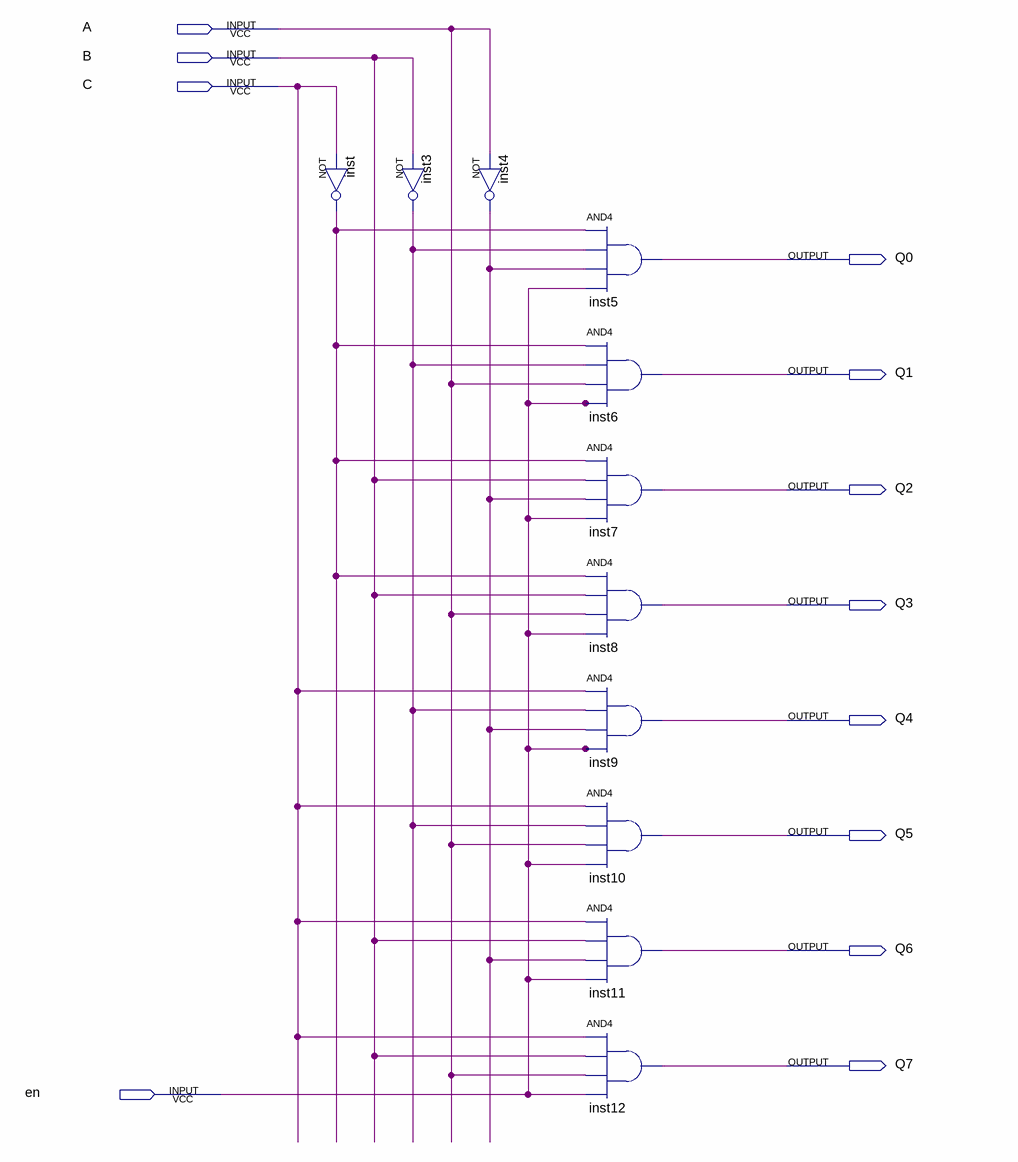
[diagram p0: schematic sheet]
// Quartus schematic ex_05.bdf as structural Verilog: 11 symbols, 12 pins
module ex_05 (
  input  A,
  input  B,
  input  C,
  input  en,
  output Q0,
  output Q1,
  output Q2,
  output Q3,
  output Q4,
  output Q5,
  output Q6,
  output Q7
);

  wire inst3_out, inst4_out, inst_out;

  not inst (inst_out, C);
  not inst3 (inst3_out, B);
  not inst4 (inst4_out, A);
  and inst5 (Q0, inst_out, inst3_out, inst4_out, en);
  and inst6 (Q1, inst_out, inst3_out, A, en);
  and inst7 (Q2, inst_out, B, inst4_out, en);
  and inst8 (Q3, inst_out, B, A, en);
  and inst9 (Q4, C, inst3_out, inst4_out, en);
  and inst10 (Q5, C, inst3_out, A, en);
  and inst11 (Q6, C, B, inst4_out, en);
  and inst12 (Q7, C, B, A, en);
endmodule
